# EAGLE design eeprom_emu_bt_satland_fix (EAGLE 7.6.0)
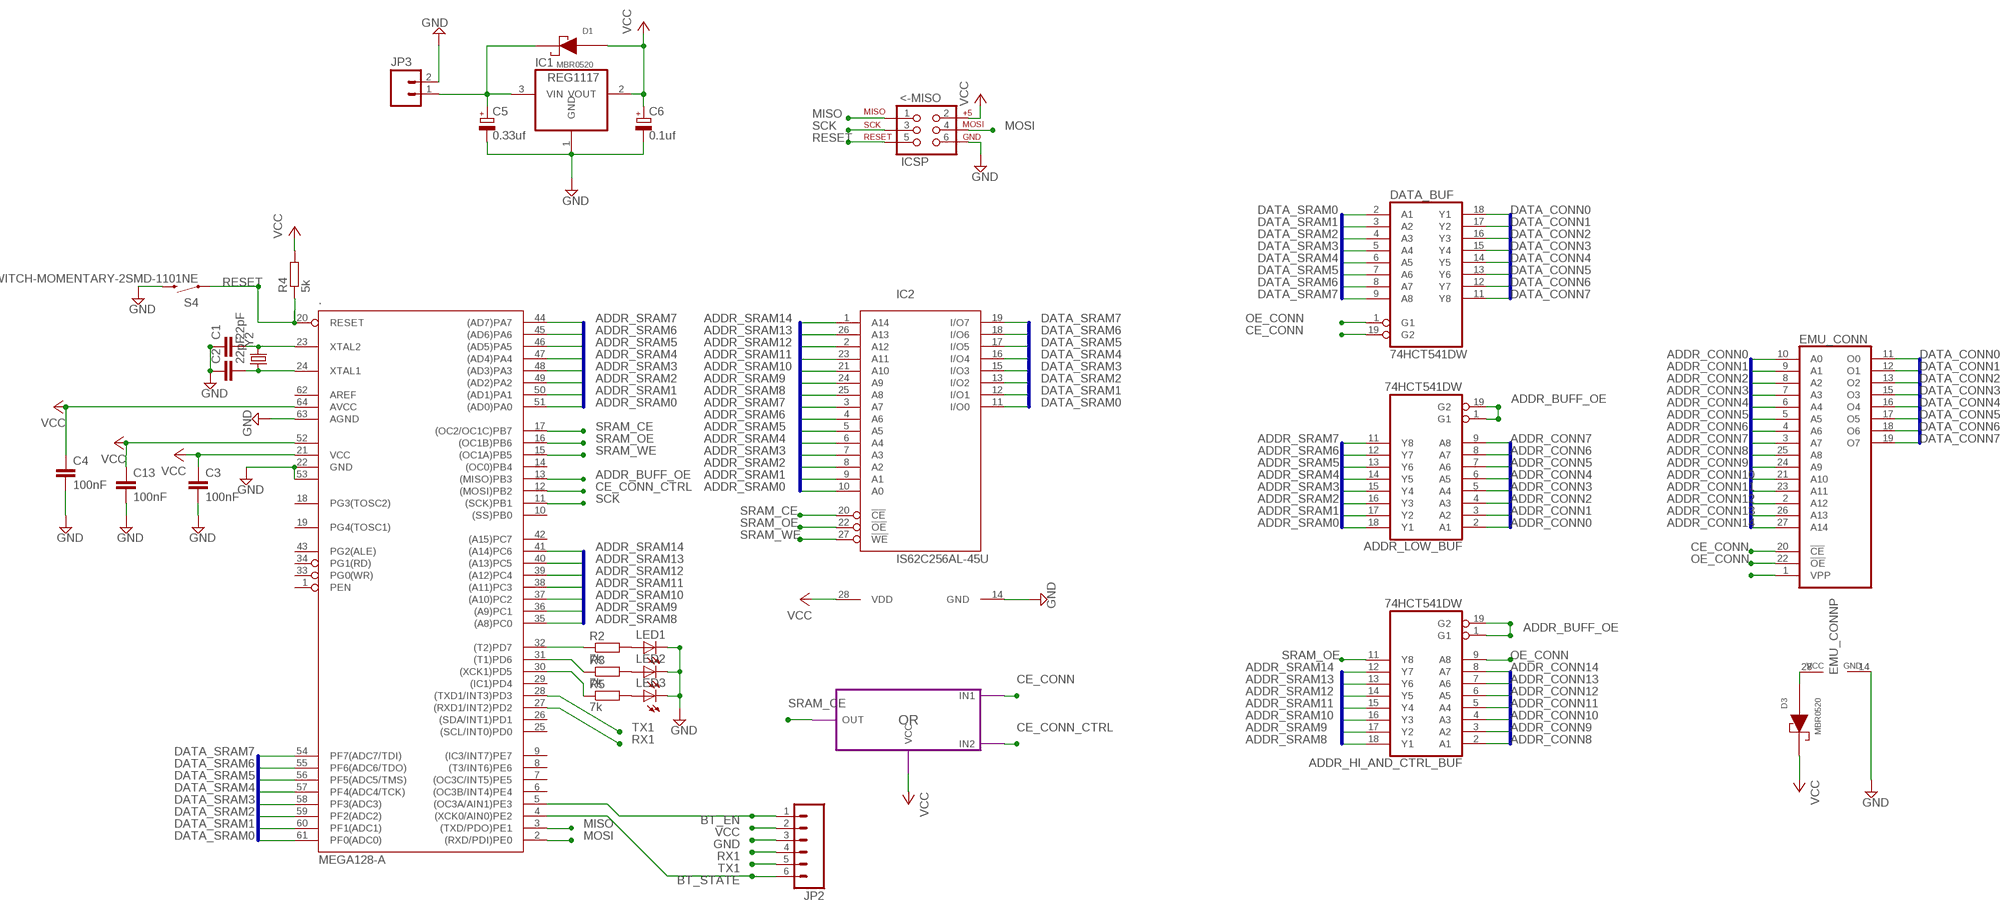
[diagram p0: schematic, sheet 1]

## Parts
.  MEGA128-A  [TQFP64]
<-MISO  ICSP  AVR_SPI_PRG_6PTH  [2X3]
ADDR_HI_AND_CTRL_BUF  74HCT541DW  [SO20W]
ADDR_LOW_BUF  74HCT541DW  [SO20W]
C1  22pF  C-EUC0805  [C0805]
C2  22pF  C-EUC0805  [C0805]
C3  100nF  C-EUC0805  [C0805]
C4  100nF  C-EUC0805  [C0805]
C5  0.33uf  CPOL-EUE5-4  [E5-4]
C6  0.1uf  CPOL-EUE5-4  [E5-4]
C13  100nF  C-EUC0805  [C0805]
D1  MBR0520  [SOD-123]
D3  MBR0520  [SOD-123]
DATA_BUF  74HCT541DW  [SO20W]
EMU_CONN  27256  [DIL28]
IC1  REG1117  [SOT223]
IC2  IS62C256AL-45U  [SOP28-330MIL]
JP2  M06SILK_FEMALE_PTH  [1X06]
JP3  M02LOCK_LONGPADS  [1X02_LOCK_LONGPADS]
LED1  LEDSML0805  [SML0805]
LED2  LEDSML0805  [SML0805]
LED3  LEDSML0805  [SML0805]
R2  7k  R-EU_R0805  [R0805]
R3  7k  R-EU_R0805  [R0805]
R4  5k  R-EU_R0805  [R0805]
R5  7k  R-EU_R0805  [R0805]
S4  SWITCH-MOMENTARY-2SMD-1101NE  [TACTILE-SWITCH-1101NE]
Y2  CRYSTALHC49UV  [HC49U-V]

## Module instances
OR = OR_GATE

## Nets
ADDR_BUFF_OE: ..13((MISO)PB3) ADDR_HI_AND_CTRL_BUF.1(G1) ADDR_HI_AND_CTRL_BUF.19(G2) ADDR_LOW_BUF.1(G1) ADDR_LOW_BUF.19(G2)
ADDR_CONN0: ADDR_LOW_BUF.2(A1) EMU_CONN.10(A0)
ADDR_CONN1: ADDR_LOW_BUF.3(A2) EMU_CONN.9(A1)
ADDR_CONN2: ADDR_LOW_BUF.4(A3) EMU_CONN.8(A2)
ADDR_CONN3: ADDR_LOW_BUF.5(A4) EMU_CONN.7(A3)
ADDR_CONN4: ADDR_LOW_BUF.6(A5) EMU_CONN.6(A4)
ADDR_CONN5: ADDR_LOW_BUF.7(A6) EMU_CONN.5(A5)
ADDR_CONN6: ADDR_LOW_BUF.8(A7) EMU_CONN.4(A6)
ADDR_CONN7: ADDR_LOW_BUF.9(A8) EMU_CONN.3(A7)
ADDR_CONN8: ADDR_HI_AND_CTRL_BUF.2(A1) EMU_CONN.25(A8)
ADDR_CONN9: ADDR_HI_AND_CTRL_BUF.3(A2) EMU_CONN.24(A9)
ADDR_CONN10: ADDR_HI_AND_CTRL_BUF.4(A3) EMU_CONN.21(A10)
ADDR_CONN11: ADDR_HI_AND_CTRL_BUF.5(A4) EMU_CONN.23(A11)
ADDR_CONN12: ADDR_HI_AND_CTRL_BUF.6(A5) EMU_CONN.2(A12)
ADDR_CONN13: ADDR_HI_AND_CTRL_BUF.7(A6) EMU_CONN.26(A13)
ADDR_CONN14: ADDR_HI_AND_CTRL_BUF.8(A7) EMU_CONN.27(A14)
ADDR_SRAM0: ..51((AD0)PA0) ADDR_LOW_BUF.18(Y1) IC2.10(A0)
ADDR_SRAM1: ..50((AD1)PA1) ADDR_LOW_BUF.17(Y2) IC2.9(A1)
ADDR_SRAM2: ..49((AD2)PA2) ADDR_LOW_BUF.16(Y3) IC2.8(A2)
ADDR_SRAM3: ..48((AD3)PA3) ADDR_LOW_BUF.15(Y4) IC2.7(A3)
ADDR_SRAM4: ..47((AD4)PA4) ADDR_LOW_BUF.14(Y5) IC2.6(A4)
ADDR_SRAM5: ..46((AD5)PA5) ADDR_LOW_BUF.13(Y6) IC2.5(A5)
ADDR_SRAM6: ..45((AD6)PA6) ADDR_LOW_BUF.12(Y7) IC2.4(A6)
ADDR_SRAM7: ..44((AD7)PA7) ADDR_LOW_BUF.11(Y8) IC2.3(A7)
ADDR_SRAM8: ..35((A8)PC0) ADDR_HI_AND_CTRL_BUF.18(Y1) IC2.25(A8)
ADDR_SRAM9: ..36((A9)PC1) ADDR_HI_AND_CTRL_BUF.17(Y2) IC2.24(A9)
ADDR_SRAM10: ..37((A10)PC2) ADDR_HI_AND_CTRL_BUF.16(Y3) IC2.21(A10)
ADDR_SRAM11: ..38((A11)PC3) ADDR_HI_AND_CTRL_BUF.15(Y4) IC2.23(A11)
ADDR_SRAM12: ..39((A12)PC4) ADDR_HI_AND_CTRL_BUF.14(Y5) IC2.2(A12)
ADDR_SRAM13: ..40((A13)PC5) ADDR_HI_AND_CTRL_BUF.13(Y6) IC2.26(A13)
ADDR_SRAM14: ..41((A14)PC6) ADDR_HI_AND_CTRL_BUF.12(Y7) IC2.1(A14)
BT_EN: ..5((OC3A/AIN1)PE3) JP2.1
BT_STATE: ..4((XCK0/AIN0)PE2) JP2.6
CE_CONN: DATA_BUF.19(G2) EMU_CONN.20(!CE) ; port OR.IN1
CE_CONN_CTRL: ..12((MOSI)PB2) ; port OR.IN2
DATA_CONN0: DATA_BUF.18(Y1) EMU_CONN.11(O0)
DATA_CONN1: DATA_BUF.17(Y2) EMU_CONN.12(O1)
DATA_CONN2: DATA_BUF.16(Y3) EMU_CONN.13(O2)
DATA_CONN3: DATA_BUF.15(Y4) EMU_CONN.15(O3)
DATA_CONN4: DATA_BUF.14(Y5) EMU_CONN.16(O4)
DATA_CONN5: DATA_BUF.13(Y6) EMU_CONN.17(O5)
DATA_CONN6: DATA_BUF.12(Y7) EMU_CONN.18(O6)
DATA_CONN7: DATA_BUF.11(Y8) EMU_CONN.19(O7)
DATA_SRAM0: ..61(PF0(ADC0)) DATA_BUF.2(A1) IC2.11(I/O0)
DATA_SRAM1: ..60(PF1(ADC1)) DATA_BUF.3(A2) IC2.12(I/O1)
DATA_SRAM2: ..59(PF2(ADC2)) DATA_BUF.4(A3) IC2.13(I/O2)
DATA_SRAM3: ..58(PF3(ADC3)) DATA_BUF.5(A4) IC2.15(I/O3)
DATA_SRAM4: ..57(PF4(ADC4/TCK)) DATA_BUF.6(A5) IC2.16(I/O4)
DATA_SRAM5: ..56(PF5(ADC5/TMS)) DATA_BUF.7(A6) IC2.17(I/O5)
DATA_SRAM6: ..55(PF6(ADC6/TDO)) DATA_BUF.8(A7) IC2.18(I/O6)
DATA_SRAM7: ..54(PF7(ADC7/TDI)) DATA_BUF.9(A8) IC2.19(I/O7)
GND: ..22(GND) ..53(GND1) ..63(AGND) <-MISO.6 C1.1 C2.1 C3.2 C4.2 C5.- C6.- C13.2 EMU_CONN.14(GND) IC1.1(GND) IC2.14(GND) JP2.3 JP3.2 LED1.C LED2.C LED3.C S4.2
MISO: ..3((TXD/PDO)PE1) <-MISO.1
MOSI: ..2((RXD/PDI)PE0) <-MISO.4
N$1: ..24(XTAL1) C2.2 Y2.1
N$2: ..23(XTAL2) C1.2 Y2.2
N$3: C5.+ D1.1(CA) IC1.3(VIN) JP3.1
N$4: D3.2(AN) EMU_CONN.28(VCC)
N$6: ..32((T2)PD7) R2.1
N$7: LED1.A R2.2
N$8: ..31((T1)PD6) R3.1
N$9: EMU_CONN.1(VPP)
N$10: LED2.A R3.2
N$11: ..30((XCK1)PD5) R5.1
N$12: LED3.A R5.2
OE_CONN: ADDR_HI_AND_CTRL_BUF.9(A8) DATA_BUF.1(G1) EMU_CONN.22(!OE)
RESET: ..20(RESET) <-MISO.5 R4.1 S4.1
RX1: ..27((RXD1/INT2)PD2) JP2.4
SCK: ..11((SCK)PB1) <-MISO.3
SRAM_CE: ..17((OC2/OC1C)PB7) IC2.20(!CE) ; port OR.OUT
SRAM_OE: ..16((OC1B)PB6) ADDR_HI_AND_CTRL_BUF.11(Y8) IC2.22(!OE)
SRAM_WE: ..15((OC1A)PB5) IC2.27(!WE)
TX1: ..28((TXD1/INT3)PD3) JP2.5
VCC: ..21(VCC) ..52(VCC1) ..64(AVCC) <-MISO.2 C3.1 C4.1 C6.+ C13.1 D1.2(AN) D3.1(CA) IC1.2(VOUT) IC2.28(VDD) JP2.2 R4.2 ; port OR.VCC
Unconnected: ..1(PEN) ..6((OC3B/INT4)PE4) ..7((OC3C/INT5)PE5) ..8((T3/INT6)PE6) ..9((IC3/INT7)PE7) ..10((SS)PB0) ..14((OC0)PB4) ..18(PG3(TOSC2)) ..19(PG4(TOSC1)) ..25((SCL/INT0)PD0) ..26((SDA/INT1)PD1) ..29((IC1)PD4) ..33(PG0(WR)) ..34(PG1(RD)) ..42((A15)PC7) ..43(PG2(ALE)) ..62(AREF)

## Buses
ADDR_SRAM[0..14]
DATA_SRAM[0..7]
DATA_CONN[0..7]
ADDR_CONN[0..7]
ADDR_CONN[8..14]
ADDR_SRAM[0..7]
ADDR_SRAM[8..14]
ADDR_CONN[0..14]

## Power pins joined to a net without a drawn wire
GND: ADDR_HI_AND_CTRL_BUF.10(GND) ADDR_LOW_BUF.10(GND) DATA_BUF.10(GND)
VCC: ADDR_HI_AND_CTRL_BUF.20(VCC) ADDR_LOW_BUF.20(VCC) DATA_BUF.20(VCC)

## Library data of the parts
. = avr-7:MEGA128: MICROCONTROLLER 128 Kbytes FLASH 4 Kbytes SRAM 4 Kbytes EEPROM DUAL USART 8-channel 10 bit ADC
<-MISO = SparkFun-Connectors:AVR_SPI_PRG_6: AVR ISP 6 Pin This is the reduced ISP connector for AVR programming. Common on Arduino. This footprint will take up less PCB space and can be used with a 10-pin to 6-pin adapter such as SKU: BOB-08508 **Special note about "TEST_POINT" package. The stop mask is on the top side, so if you want your programming test points to be on the bottom of your board, make sure to place this package on the bottom side of the board. This also ensure that the orientation to program from the bottom side will be correct.
ADDR_HI_AND_CTRL_BUF ADDR_LOW_BUF DATA_BUF = 74xx-eu:74*541: Octal BUFFER and LINE DRIVER, 3-state
C1-C4 C13 = resistor:C-EU: CAPACITOR, European symbol
C5 C6 = rcl:CPOL-EU: POLARIZED CAPACITOR, European symbol
D1 D3 = MySMD:MBR0520
EMU_CONN = memory:27256: MEMORY
IC1 = burr-brown:REG1117: 800mA and 1A Low Dropout (LDO) Positive Regulator 1.8V, 2.5V, 2.85V, 3.3V, 5V, and Adj; MPN: REG1117; OC_FARNELL: 1097566; OC_NEWARK: 14P6981
IC2 = memory-issi-asynsram:IS62C256AL-*: 32k x 8 low power CMOS static RAM 25ns and 45ns access time 5V power supply
JP2 = SparkFun-Connectors:M06: Header 6 Standard 6-pin 0.1" header. Use with straight break away headers (SKU : PRT-00116), right angle break away headers (PRT-00553), swiss pins (PRT-00743), machine pins (PRT-00117), and female headers (PRT-00115). Molex polarized connector foot print use with SKU : PRT-08094 with associated crimp pins and housings. NOTES ON THE VARIANTS LOCK and LOCK_LONGPADS... This footprint was designed to help hold the alignment of a through-hole component (i.e. 6-pin header) while soldering it into place. You may notice that each hole has been shifted either up or down by 0.005 of an inch from it's more standard position (which is a perfectly straight line). This slight alteration caused the pins (the squares in the middle) to touch the edges of the holes. Because they are alternating, it causes a "brace" to hold the component in place. 0.005 has proven to be the perfect amount of "off-center" position when using our standard breakaway headers. Although looks a little odd when you look at the bare footprint, once you have a header in there, the alteration is very hard to notice. Also,if you push a header all the way into place, it is covered up entirely on the bottom side. This idea of altering the position of holes to aid alignment will be further integrated into the Sparkfun Library for other footprints. It can help hold any component with 3 or more connection pins.; PROD_ID: CONN-08437
JP3 = SparkFun-Connectors:M02: Standard 2-pin 0.1" header. Use with - straight break away headers ( PRT-00116) - right angle break away headers (PRT-00553) - swiss pins (PRT-00743) - machine pins (PRT-00117) - female headers (PRT-00115) Molex polarized connector foot print use with: PRT-08233 with associated crimp pins and housings. 2.54_SCREWTERM for use with PRT-10571. 3.5mm Screw Terminal footprints for PRT-08084 5mm Screw Terminal footprints for use with PRT-08432
LED1-LED3 = led:LED: LED OSRAM: - CHIPLED LG R971, LG N971, LY N971, LG Q971, LY Q971, LO R971, LY R971 LH N974, LH R974 LS Q976, LO Q976, LY Q976 LO Q996 - Hyper CHIPLED LW Q18S LB Q993, LB Q99A, LB R99A - SideLED LS A670, LO A670, LY A670, LG A670, LP A670 LB A673, LV A673, LT A673, LW A673 LH A674 LY A675 LS A676, LA A676, LO A676, LY A676, LW A676 LS A679, LY A679, LG A679 - Hyper Micro SIDELED® LS Y876, LA Y876, LO Y876, LY Y876 LT Y87S - SmartLED LW L88C, LW L88S LB L89C, LB L89S, LG L890 LS L89K, LO L89K, LY L89K LS L896, LA L896, LO L896, LY L896 - TOPLED LS T670, LO T670, LY T670, LG T670, LP T670 LSG T670, LSP T670, LSY T670, LOP T670, LYG T670 LG T671, LOG T671, LSG T671 LB T673, LV T673, LT T673, LW T673 LH T674 LS T676, LA T676, LO T676, LY T676, LB T676, LH T676, LSB T676, LW T676 LB T67C, LV T67C, LT T67C, LS T67K, LO T67K, LY T67K, LW E67C LS E67B, LA E67B, LO E67B, LY E67B, LB E67C, LV E67C, LT E67C LW T67C LS T679, LY T679, LG T679 LS T770, LO T770, LY T770, LG T770, LP T770 LB T773, LV T773, LT T773, LW T773 LH T774 LS E675, LA E675, LY E675, LS T675 LS T776, LA T776, LO T776, LY T776, LB T776 LHGB T686 LT T68C, LB T68C - Hyper Mini TOPLED® LB M676 - Mini TOPLED Santana® LG M470 LS M47K, LO M47K, LY M47K Source: http://www.osram.convergy.de LUXEON: - LUMILED® LXK2-PW12-R00, LXK2-PW12-S00, LXK2-PW14-U00, LXK2-PW14-V00 LXK2-PM12-R00, LXK2-PM12-S00, LXK2-PM14-U00 LXK2-PE12-Q00, LXK2-PE12-R00, LXK2-PE12-S00, LXK2-PE14-T00, LXK2-PE14-U00 LXK2-PB12-K00, LXK2-PB12-L00, LXK2-PB12-M00, LXK2-PB14-N00, LXK2-PB14-P00, LXK2-PB14-Q00 LXK2-PR12-L00, LXK2-PR12-M00, LXK2-PR14-Q00, LXK2-PR14-R00 LXK2-PD12-Q00, LXK2-PD12-R00, LXK2-PD12-S00 LXK2-PH12-R00, LXK2-PH12-S00 LXK2-PL12-P00, LXK2-PL12-Q00, LXK2-PL12-R00 Source: www.luxeon.com KINGBRIGHT: KA-3528ASYC Source: www.kingbright.com
R2-R5 = rcl:R-EU_: RESISTOR, European symbol
S4 = SparkFun-Electromechanical:SWITCH-MOMENTARY-2: Various NO switches- pushbuttons, reed, etc; PROD_ID: SWCH-00815
Y2 = SparkFun-FreqCtrl:CRYSTAL: Various standard crystals. Proven footprints.

## Module OR_GATE
Ports: IN1(in) IN2(in) VCC(pwr) OUT(out)
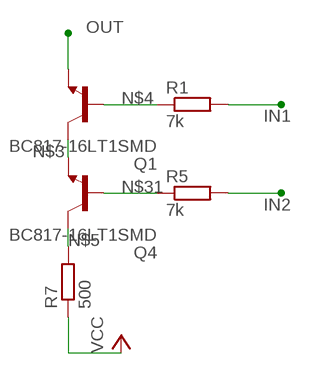
[diagram p1: schematic, module OR_GATE, sheet 1]

### Parts
Q1  BC817-16LT1SMD  [SOT23-BEC]
Q4  BC817-16LT1SMD  [SOT23-BEC]
R1  7k  R-EU_R0805  [R0805]
R5  7k  R-EU_R0805  [R0805]
R7  500  R-EU_R0805  [R0805]

### Nets
IN1: R1.2
IN2: R5.2
N$3: Q1.C Q4.E
N$4: Q1.B R1.1
N$5: Q4.C R7.2
N$31: Q4.B R5.1
OUT: Q1.E
VCC: R7.1

### Library data of the parts
Q1 Q4 = transistor-npn:BC817*: NPN Transistor
R1 R5 R7 = rcl:R-EU_: RESISTOR, European symbol

## Board
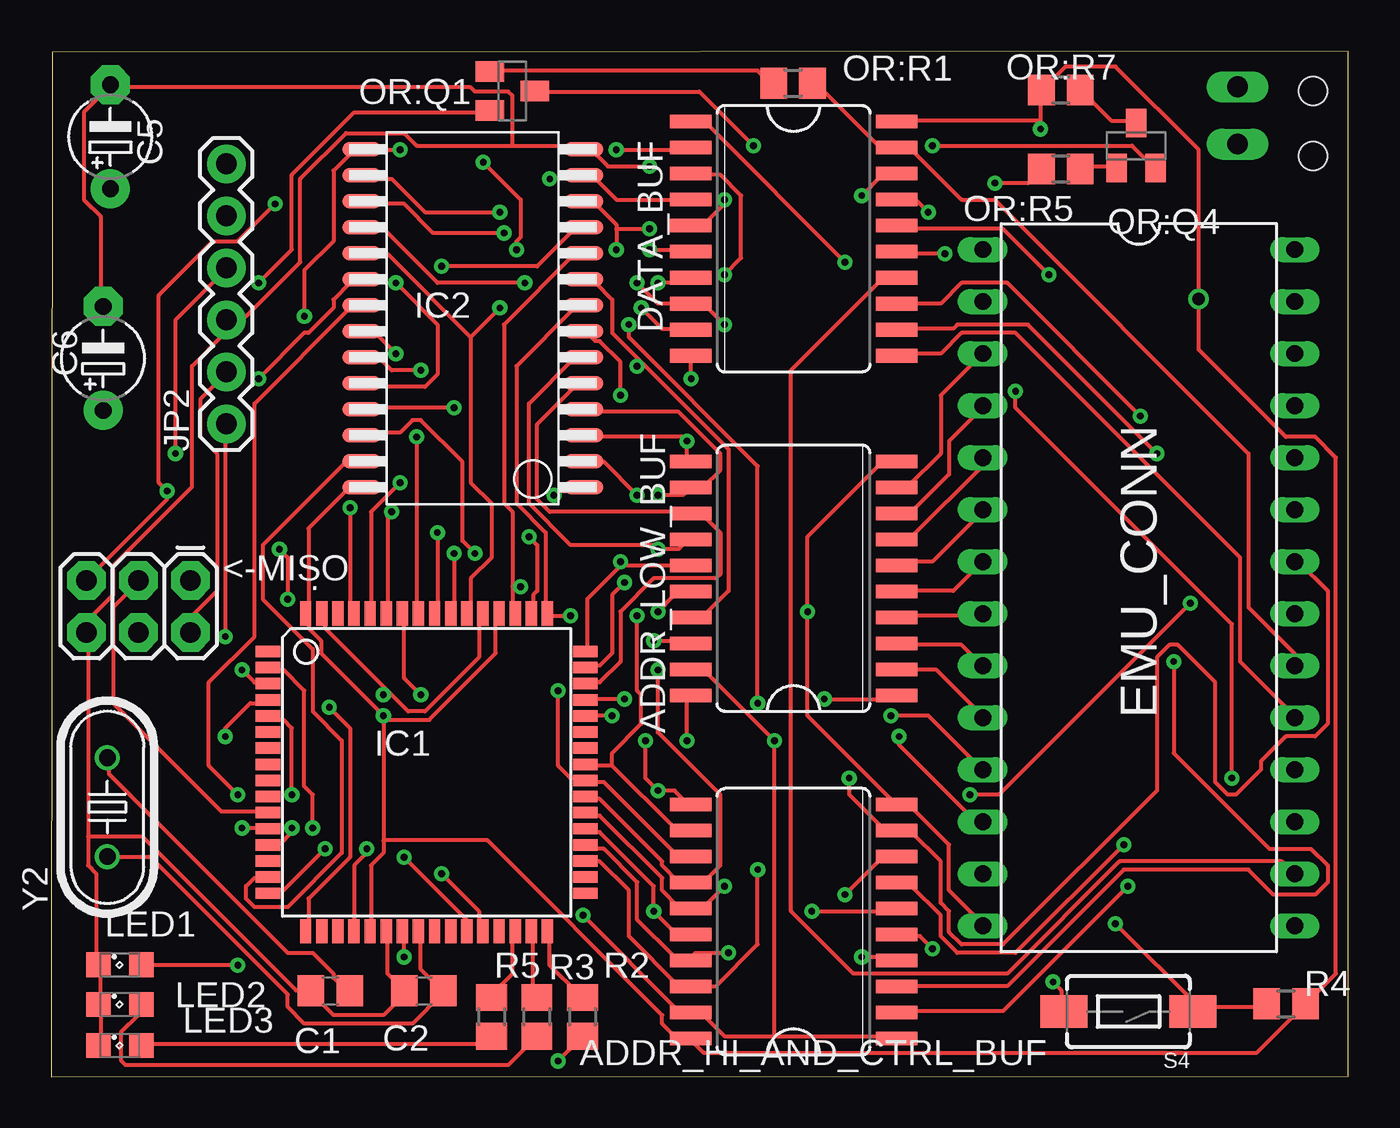
[diagram p2: board, top side]
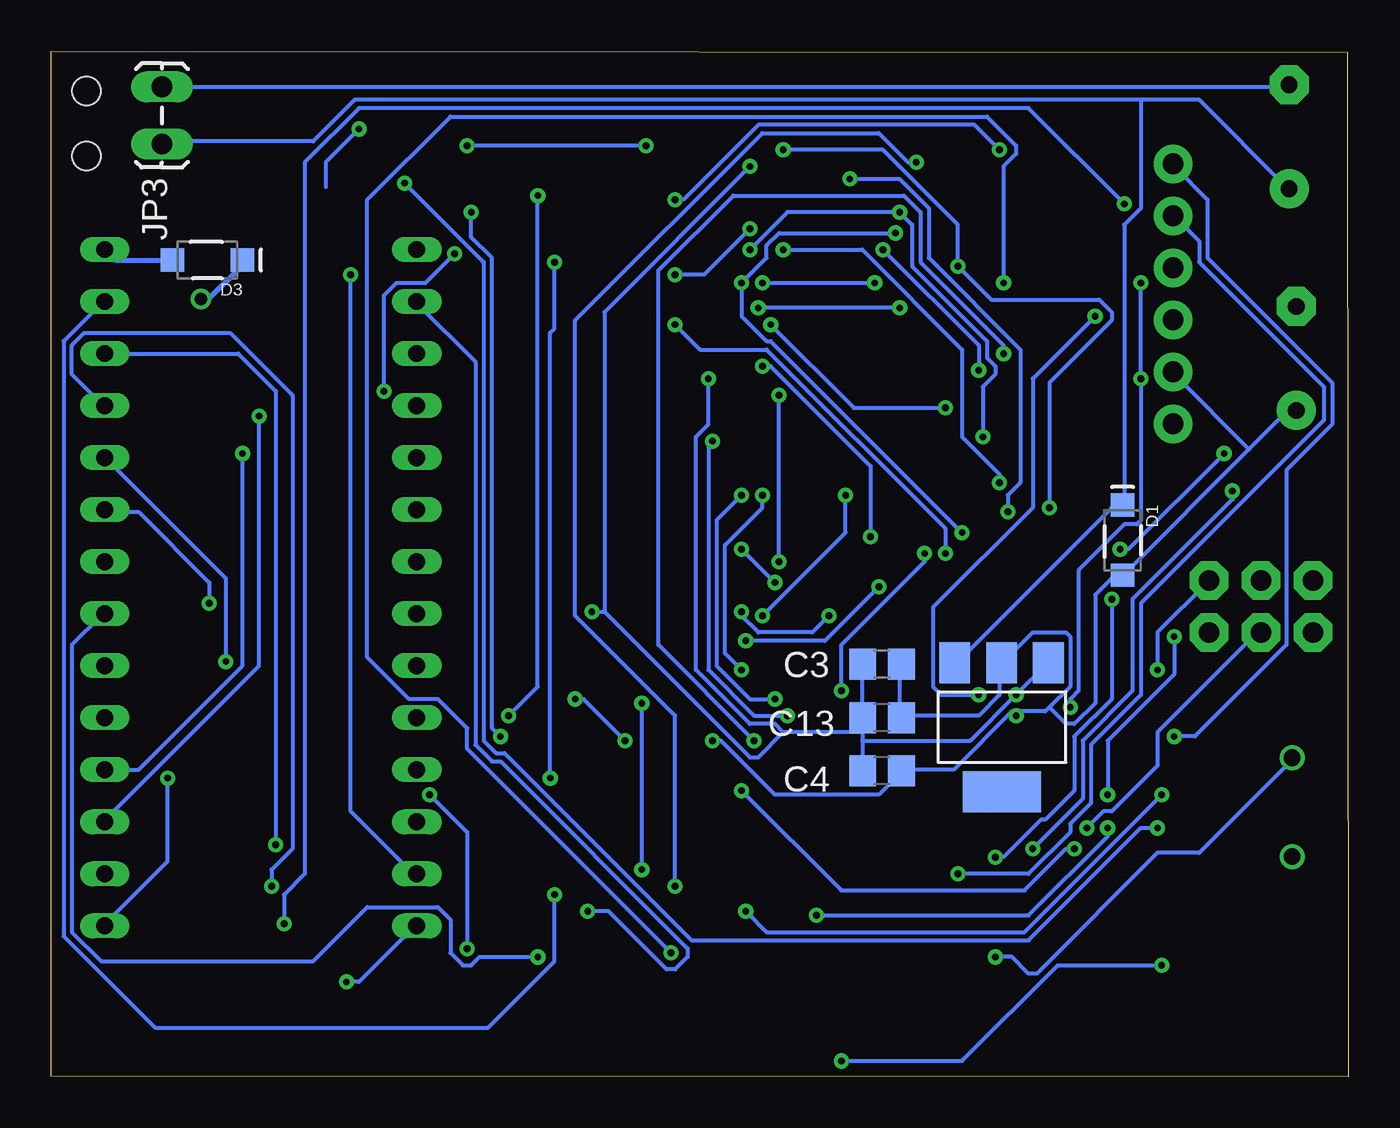
[diagram p3: board, bottom side, seen from below]

Size 63.37 x 50.08 mm. Coordinates in mm from the lower left corner, seen from the top.
Outline: 0,0 63.37,0.02 63.37,50.08 0.05,50.03 0,0
Copper layers (1*16): Top 0.0356mm / dielectric 1.5011mm / Bottom 0.0356mm
Design rules "oshpark-2layer *": minimum track width 8mil, minimum drill 13mil, track to track 8mil, track to pad 8mil, pad to pad 8mil, via to via 8mil, smd to smd 6mil, copper to edge 15mil, drill to drill 6mil, minimum pad ring 8mil, minimum via ring 8mil, stop-mask expansion 2.5mil, vias tented up to drill 0mil, thermal gap 10mil
Holes 1.4 mm at 61.65,44.96 61.65,48.13

### Footprints (pad centres in the part's own frame; a part is rotated, then mirrored left to right if it is on the bottom)
TQFP64 = smd 1.194 x 0.559: 1 -7.76,5.905; 2 -7.76,5.118; 3 -7.76,4.331; 4 -7.76,3.543; 5 -7.76,2.756; 6 -7.76,1.968; 7 -7.76,1.181; 8 -7.76,0.394; 9 -7.76,-0.394; 10 -7.76,-1.181; 11 -7.76,-1.968; 12 -7.76,-2.756; 13 -7.76,-3.543; 14 -7.76,-4.331; 15 -7.76,-5.118; 16 -7.76,-5.905; 33 7.76,-5.905; 34 7.76,-5.118; 35 7.76,-4.331; 36 7.76,-3.543; 37 7.76,-2.756; 38 7.76,-1.968; 39 7.76,-1.181; 40 7.76,-0.394; 41 7.76,0.394; 42 7.76,1.181; 43 7.76,1.968; 44 7.76,2.756; 45 7.76,3.543; 46 7.76,4.331; 47 7.76,5.118; 48 7.76,5.905 | smd 0.559 x 1.194: 17 -5.905,-7.76; 18 -5.118,-7.76; 19 -4.331,-7.76; 20 -3.543,-7.76; 21 -2.756,-7.76; 22 -1.968,-7.76; 23 -1.181,-7.76; 24 -0.394,-7.76; 25 0.394,-7.76; 26 1.181,-7.76; 27 1.968,-7.76; 28 2.756,-7.76; 29 3.543,-7.76; 30 4.331,-7.76; 31 5.118,-7.76; 32 5.905,-7.76; 49 5.905,7.76; 50 5.118,7.76; 51 4.331,7.76; 52 3.543,7.76; 53 2.756,7.76; 54 1.968,7.76; 55 1.181,7.76; 56 0.394,7.76; 57 -0.394,7.76; 58 -1.181,7.76; 59 -1.968,7.76; 60 -2.756,7.76; 61 -3.543,7.76; 62 -4.331,7.76; 63 -5.118,7.76; 64 -5.905,7.76
2X3 = drill 1.016 pad 1.88 octagon: 1 0,0; 2 0,2.54; 3 2.54,0; 4 2.54,2.54; 5 5.08,0; 6 5.08,2.54
SO20W = smd 0.66 x 2.032: 1 -5.715,-5.029; 2 -4.445,-5.029; 3 -3.175,-5.029; 4 -1.905,-5.029; 5 -0.635,-5.029; 6 0.635,-5.029; 7 1.905,-5.029; 8 3.175,-5.029; 9 4.445,-5.029; 10 5.715,-5.029; 11 5.715,5.029; 12 4.445,5.029; 13 3.175,5.029; 14 1.905,5.029; 15 0.635,5.029; 16 -0.635,5.029; 17 -1.905,5.029; 18 -3.175,5.029; 19 -4.445,5.029; 20 -5.715,5.029
C0805 = smd 1.3 x 1.5: 1 -0.95,0; 2 0.95,0
E5-4 = drill 0.813 pad 1.905: + -2.54,0 | drill 0.813 pad 1.905 octagon: - 2.54,0
SOD-123 = smd 1.143 x 1.143: 1 0,0; 2 3.429,0
DIL28 = drill 0.813 long: 1 -16.51,-7.62; 2 -13.97,-7.62; 3 -11.43,-7.62; 4 -8.89,-7.62; 5 -6.35,-7.62; 6 -3.81,-7.62; 7 -1.27,-7.62; 8 1.27,-7.62; 9 3.81,-7.62; 10 6.35,-7.62; 11 8.89,-7.62; 12 11.43,-7.62; 13 13.97,-7.62; 14 16.51,-7.62; 15 16.51,7.62; 16 13.97,7.62; 17 11.43,7.62; 18 8.89,7.62; 19 6.35,7.62; 20 3.81,7.62; 21 1.27,7.62; 22 -1.27,7.62; 23 -3.81,7.62; 24 -6.35,7.62; 25 -8.89,7.62; 26 -11.43,7.62; 27 -13.97,7.62; 28 -16.51,7.62
SOT223 = smd 1.499 x 2.007: 1 -2.261,-3.15; 2 0.025,-3.15; 3 2.311,-3.15 | smd 3.81 x 2.007: 4 0,3.15
SOP28-330MIL = smd 0.7 x 1.9: 1 -8.255,-5.415; 2 -6.985,-5.415; 3 -5.715,-5.415; 4 -4.445,-5.415; 5 -3.175,-5.415; 6 -1.905,-5.415; 7 -0.635,-5.415; 8 0.635,-5.415; 9 1.905,-5.415; 10 3.175,-5.415; 11 4.445,-5.415; 12 5.715,-5.415; 13 6.985,-5.415; 14 8.255,-5.415; 15 8.255,5.415; 16 6.985,5.415; 17 5.715,5.415; 18 4.445,5.415; 19 3.175,5.415; 20 1.905,5.415; 21 0.635,5.415; 22 -0.635,5.415; 23 -1.905,5.415; 24 -3.175,5.415; 25 -4.445,5.415; 26 -5.715,5.415; 27 -6.985,5.415; 28 -8.255,5.415
1X06 = drill 1.016 pad 1.88: 1 0,0; 2 2.54,0; 3 5.08,0; 4 7.62,0; 5 10.16,0; 6 12.7,0
1X02_LOCK_LONGPADS = drill 1.016 long: 1 -0.127,0; 2 2.667,0
SML0805 = smd 1.2 x 1.2: A 1.05,0; C -1.05,0
SOT23-BEC = smd 1 x 1.4: B -0.95,-1.1; C 0,1.1; E 0.95,-1.1
R0805 = smd 1.3 x 1.5: 1 -0.95,0; 2 0.95,0
TACTILE-SWITCH-1101NE = smd 2.3 x 1.6: 1 -3.15,0; 2 3.15,0
HC49U-V = drill 0.813: 1 -2.413,0; 2 2.413,0

### Placement (x,y rotation side)
.  18.34,14.86 0 top
<-MISO  6.81,24.23 180 top
ADDR_HI_AND_CTRL_BUF  36.27,7.57 90 top
ADDR_LOW_BUF  36.27,24.33 90 top
C1  13.64,4.19 0 top
C2  18.21,4.19 0 top
C3  22.78,20.14 180 bottom
C4  22.78,14.94 180 bottom
C5  2.9,45.9 90 top
C6  2.54,35.08 90 top
C13  22.78,17.53 180 bottom
D1  11.02,27.91 270 bottom
D3  54.03,39.88 180 bottom
DATA_BUF  36.27,40.92 270 top
EMU_CONN  53.14,23.88 270 top
IC1  16.92,17.07 180 bottom
IC2  20.6,37.03 90 top
JP2  8.56,31.88 90 top
JP3  57.96,45.67 90 bottom
LED1  3.35,5.46 0 top
LED2  3.35,3.53 0 top
LED3  3.35,1.52 0 top
OR:Q1  BC817-16LT1SMD  [SOT23-BEC]  22.53,48.13 270 top
OR:Q4  BC817-16LT1SMD  [SOT23-BEC]  53.01,45.47 0 top
OR:R1  7k  [R0805]  36.25,48.51 0 top
OR:R5  7k  [R0805]  49.33,44.32 180 top
OR:R7  500  [R0805]  49.33,48.18 0 top
R2  25.96,2.92 270 top
R3  23.72,2.92 270 top
R4  60.33,3.56 0 top
R5  21.51,2.92 270 top
S4  52.63,3.17 180 top
Y2  2.74,13.16 90 top

### Tracks (layer width: path | path; a pad name or v marks a point on that pad's centre or on a via)
ADDR_BUFF_OE  (via drill 0.33)
  Top 0.203: v11.76,12.14 11.76,11.94 11.15,11.33 10.74,11.33 ..13 | v25.98,7.87 30.66,3.2 31.06,3.2 ADDR_HI_AND_CTRL_BUF.19 31.27,3 31.88,3 32.89,1.98 35.33,1.98 | 35.33,1.98 41.22,1.98 ADDR_HI_AND_CTRL_BUF.1 | 35.33,1.98 v35.33,16.41 31.88,19.86 31.27,19.86 ADDR_LOW_BUF.19 | v37.77,18.44 41.22,18.44 ADDR_LOW_BUF.1
  Bottom 0.203: v11.76,12.14 11.76,11.73 15.62,7.87 v25.98,7.87 | v37.77,18.44 37.36,18.44 v35.33,16.41
ADDR_CONN0
  Top 0.203: ADDR_LOW_BUF.2 41.43,19.86 43.26,19.86 45.49,17.63 EMU_CONN.10
ADDR_CONN1
  Top 0.203: ADDR_LOW_BUF.3 41.43,21.08 44.48,21.08 45.49,20.07 EMU_CONN.9
ADDR_CONN2
  Top 0.203: ADDR_LOW_BUF.4 41.43,22.5 45.49,22.5 EMU_CONN.8
ADDR_CONN3
  Top 0.203: ADDR_LOW_BUF.5 41.43,23.72 44.07,23.72 45.49,25.15 EMU_CONN.7
ADDR_CONN4
  Top 0.203: ADDR_LOW_BUF.6 41.43,25.15 43.05,25.15 45.49,27.58 EMU_CONN.6
ADDR_CONN5
  Top 0.203: ADDR_LOW_BUF.7 41.43,26.36 42.04,26.36 45.49,29.82 45.49,30.23 EMU_CONN.5
ADDR_CONN6
  Top 0.203: ADDR_LOW_BUF.8 41.43,27.58 42.04,27.58 43.87,29.41 43.87,31.04 45.49,32.66 EMU_CONN.4
ADDR_CONN7
  Top 0.203: ADDR_LOW_BUF.9 41.43,28.8 41.83,28.8 43.46,30.43 43.46,33.27 45.49,35.31 EMU_CONN.3
ADDR_CONN8  (via drill 0.33)
  Top 0.203: v52.6,9.3 46.51,3.2 41.43,3.2 ADDR_HI_AND_CTRL_BUF.2
  Bottom 0.203: v52.6,9.3 52.6,10.11 51.59,11.12 51.59,33.27 54.64,36.32 61.75,36.32 62.36,35.71 62.36,34.29 60.93,32.87 EMU_CONN.25
ADDR_CONN9  (via drill 0.33)
  Top 0.203: v54.84,20.27 54.84,15.8 59.51,11.12 61.54,11.12 62.36,10.31 62.36,9.5 61.75,8.89 59.72,8.89 58.5,10.11 52.4,10.11 46.71,4.42 41.43,4.42 ADDR_HI_AND_CTRL_BUF.3
  Bottom 0.203: v54.84,20.27 54.84,24.33 60.73,30.23 EMU_CONN.24
ADDR_CONN10  (via drill 0.33)
  Top 0.203: v39.6,5.84 41.22,5.84 ADDR_HI_AND_CTRL_BUF.4
  Bottom 0.203: v39.6,5.84 42.44,5.84 42.85,5.44 43.26,5.44 43.87,6.04 43.87,7.67 44.48,8.28 47.93,8.28 50.57,5.64 60.93,5.64 62.36,7.06 62.36,21.08 60.93,22.5 EMU_CONN.21
ADDR_CONN11  (via drill 0.33)
  Top 0.203: v43.05,6.25 42.44,6.86 41.43,6.86 ADDR_HI_AND_CTRL_BUF.5 | v44.88,13.77 46.3,13.77 v55.65,23.11
  Bottom 0.203: v43.05,6.25 43.05,11.94 v44.88,13.77 | v55.65,23.11 55.65,24.13 59.11,27.58 60.73,27.58 EMU_CONN.23
ADDR_CONN12  (via drill 0.33)
  Top 0.203: v37.16,8.08 41.22,8.08 ADDR_HI_AND_CTRL_BUF.6
  Bottom 0.203: v37.16,8.08 36.14,8.08 33.3,5.23 32.89,5.23 32.28,5.84 32.28,6.25 41.43,15.39 41.83,15.39 42.65,16.2 42.65,34.9 45.49,37.74 EMU_CONN.2
ADDR_CONN13  (via drill 0.33)
  Top 0.203: v52.4,11.33 47.12,6.04 44.27,6.04 43.46,6.86 43.46,7.87 42.04,9.3 41.43,9.3 ADDR_HI_AND_CTRL_BUF.7
  Bottom 0.203: v52.4,11.33 52.4,33.48 54.23,35.31 EMU_CONN.26
ADDR_CONN14  (via drill 0.33)
  Top 0.203: v38.79,8.89 40.61,10.72 41.22,10.72 ADDR_HI_AND_CTRL_BUF.8
  Bottom 0.203: v38.79,8.89 38.79,5.64 42.04,2.39 58.29,2.39 62.76,6.86 62.76,35.92 60.93,37.74 EMU_CONN.27
ADDR_SRAM0  (via drill 0.33)
  Top 0.203: 22.53,23.93 22.53,27.58 22.12,27.99 22.12,36.73 25.58,40.18 25.98,40.18 IC2.10 | 22.53,23.93 22.53,22.71 ..51 | v29.44,21.29 31.06,21.29 ADDR_LOW_BUF.18 | 22.53,23.93 v22.94,23.93
  Bottom 0.203: v29.44,21.29 25.58,21.29 v22.94,23.93
ADDR_SRAM1  (via drill 0.33)
  Top 0.203: v23.34,26.36 23.75,25.96 23.75,23.72 23.55,23.52 23.55,22.71 ..50 | 28.63,35.1 v28.63,34.7 | 28.63,35.1 27.41,36.32 27.41,37.95 26.59,38.76 26.19,38.76 IC2.9 | 28.63,35.1 33.1,30.63 33.1,23.72 31.88,22.5 31.27,22.5 ADDR_LOW_BUF.17
  Bottom 0.203: v23.34,26.36 23.34,29.82 28.22,34.7 v28.63,34.7
ADDR_SRAM2  (via drill 0.33)
  Top 0.203: IC2.8 25.98,37.54 25.58,37.54 22.73,34.7 22.73,27.99 24.16,26.57 24.16,22.71 ..49 24.36,22.5 v25.37,22.5 | v29.64,22.71 30.45,23.52 31.06,23.52 ADDR_LOW_BUF.16
  Bottom 0.203: v29.64,22.71 29.64,22.5 28.83,21.69 26.19,21.69 v25.37,22.5
ADDR_SRAM3  (via drill 0.33)
  Top 0.203: 27.81,24.94 26.19,23.32 26.19,20.88 ..48 | 27.81,24.94 31.06,24.94 ADDR_LOW_BUF.15 | v27.81,33.27 27.81,34.9 26.8,35.92 26.59,35.92 26.19,36.32 IC2.7 | 27.81,24.94 v27.81,25.15
  Bottom 0.203: v27.81,25.15 v27.81,33.27
ADDR_SRAM4  (via drill 0.33)
  Top 0.203: v28.02,24.13 27.41,23.52 27.41,20.68 26.8,20.07 26.19,20.07 ..47 | ADDR_LOW_BUF.14 31.06,26.16 30.66,25.76 v29.64,25.76 29.44,25.96 25.37,25.96 23.34,27.99 23.34,32.87 25.58,35.1 25.98,35.1 IC2.6
  Bottom 0.203: v29.64,25.76 v28.02,24.13
ADDR_SRAM5
  Top 0.203: ..46 26.19,19.25 26.8,19.25 27.81,20.27 27.81,22.71 29.44,24.33 32.49,24.33 32.69,24.54 32.69,26.57 31.88,27.38 31.27,27.38 ADDR_LOW_BUF.13 31.06,27.58 24.36,27.58 23.75,28.19 23.75,31.85 25.58,33.68 25.98,33.68 IC2.5
ADDR_SRAM6  (via drill 0.33)
  Top 0.203: v28.02,18.44 26.19,18.44 ..45 | v29.64,28.4 30.86,28.4 ADDR_LOW_BUF.12 31.27,28.8 31.88,28.8 32.69,29.62 32.69,30.43 30.66,32.46 26.19,32.46 IC2.4
  Bottom 0.203: v28.02,18.44 29.24,18.44 30.86,20.07 30.86,27.18 v29.64,28.4
ADDR_SRAM7  (via drill 0.33)
  Top 0.203: v27.41,17.63 26.19,17.63 ..44 | ADDR_LOW_BUF.11 31.06,30.23 v31.06,31.04 30.86,31.24 26.19,31.24 IC2.3
  Bottom 0.203: v27.41,17.63 29.03,17.63 31.27,19.86 31.27,30.84 v31.06,31.04
ADDR_SRAM8  (via drill 0.33)
  Top 0.203: ..35 26.19,10.52 26.8,10.52 28.22,9.09 28.22,6.86 30.66,4.42 31.06,4.42 ADDR_HI_AND_CTRL_BUF.18 31.27,4.42 32.49,4.42 34.52,6.45 v34.52,10.11 | v19.68,32.66 15.21,32.66 IC2.25 | v28.22,36.73 28.22,36.12 34.52,29.82 v34.52,18.24
  Bottom 0.203: v19.68,32.66 24.16,32.66 v28.22,36.73 | v34.52,10.11 v34.52,18.24
ADDR_SRAM9  (via drill 0.33)
  Top 0.203: ..36 26.19,11.12 27,11.12 28.63,9.5 28.63,7.67 30.45,5.84 31.06,5.84 ADDR_HI_AND_CTRL_BUF.17 31.27,5.84 31.47,6.04 v33.1,6.04 | v16.84,38.76 18.87,36.73 18.87,34.29 18.26,33.68 15.21,33.68 IC2.24
  Bottom 0.203: v16.84,38.76 16.84,44.45 16.23,45.06 16.23,45.47 17.65,46.89 43.87,46.89 47.93,42.82 47.93,20.47 45.9,18.44 44.48,18.44 43.05,17.02 43.05,16 v33.1,6.04
ADDR_SRAM10  (via drill 0.33)
  Top 0.203: ..37 26.19,11.94 26.8,11.94 29.44,9.3 v29.44,8.08 30.45,7.06 31.06,7.06 ADDR_HI_AND_CTRL_BUF.16 | v9.12,13.77 7.7,15.19 7.7,19.25 9.93,21.49 9.93,32.87 14.6,37.54 15.01,37.54 IC2.21
  Bottom 0.203: v9.12,13.77 15.82,7.06 28.42,7.06 v29.44,8.08
ADDR_SRAM11  (via drill 0.33)
  Top 0.203: ..38 26.19,12.75 26.8,12.75 29.84,9.7 29.84,9.09 30.66,8.28 31.06,8.28 ADDR_HI_AND_CTRL_BUF.15 31.27,8.28 31.88,8.28 v32.89,9.3 | v18.06,34.49 16.64,34.49 16.03,35.1 15.21,35.1 IC2.23 | v22.73,40.39 22.73,40.79 22.94,41 22.94,42.82 v21.11,44.65
  Bottom 0.203: v18.06,34.49 18.06,35.71 v22.73,40.39 | v21.11,44.65 21.51,44.65 22.94,46.08 28.63,46.08 37.77,36.93 37.77,22.5 32.89,17.63 v32.89,9.3
ADDR_SRAM12  (via drill 0.33)
  Top 0.203: ..39 26.19,13.56 26.8,13.56 29.84,10.52 29.84,10.31 30.66,9.5 31.06,9.5 ADDR_HI_AND_CTRL_BUF.14 31.27,9.5 31.88,9.5 32.69,10.31 32.69,13.77 29.64,16.82 v29.64,19.86 | v28.63,28.4 27,30.02 26.19,30.02 IC2.2
  Bottom 0.203: v28.63,28.4 28.63,27.79 30.45,25.96 30.45,20.68 v29.64,19.86
ADDR_SRAM13  (via drill 0.33)
  Top 0.203: ADDR_HI_AND_CTRL_BUF.13 31.06,10.92 30.45,10.92 27,14.38 26.19,14.38 ..40 25.98,14.58 25.37,14.58 24.76,15.19 v24.76,18.85 | v20.7,25.55 20.09,26.16 20.09,30.02 18.06,32.05 17.65,32.05 17.04,31.44 15.21,31.44 IC2.26
  Bottom 0.203: v20.7,25.55 20.7,25.15 24.76,21.08 v24.76,18.85
ADDR_SRAM14  (via drill 0.33)
  Top 0.203: 27.41,15.19 26.19,15.19 ..41 | 27.41,15.19 30.45,12.14 31.06,12.14 ADDR_HI_AND_CTRL_BUF.12 | v24.56,28.4 24.76,28.6 25.98,28.6 IC2.1 | v28.63,22.5 28.63,18.85 28.83,18.64 28.83,17.22 27.41,15.8 27.41,15.19
  Bottom 0.203: v24.56,28.4 24.56,26.57 v28.63,22.5
BT_EN  (via drill 0.33)
  Top 0.203: v11.76,13.77 11.76,17.02 11.35,17.42 10.74,17.42 ..5 | v8.51,21.49 8.51,31.85 JP2.1
  Bottom 0.203: v11.76,13.77 11.76,16.41 8.51,19.66 v8.51,21.49
BT_STATE  (via drill 0.33)
  Top 0.203: v8.51,16.61 8.51,17.02 9.73,18.24 10.54,18.24 ..4
  Bottom 0.203: v8.51,16.61 7.49,16.61 3.02,21.08 3.02,29.62 0.79,31.85 0.79,33.88 6.88,39.98 6.88,42.82 8.51,44.45 JP2.6
CE_CONN
  Top 0.203: OR:R1.2 37.36,48.51 40.41,45.47 41.22,45.47 DATA_BUF.19 41.43,45.26 42.04,45.26 44.48,42.82 46.1,42.82 58.5,30.43 58.5,22.91 60.73,20.68 60.73,20.07 EMU_CONN.20
CE_CONN_CTRL  (via drill 0.33)
  Top 0.203: v9.32,12.14 10.54,12.14 ..12 | v46.1,43.64 47.73,43.64 48.34,44.25 OR:R5.2
  Bottom 0.203: v9.32,12.14 10.13,12.14 15.62,6.65 32.08,6.65 41.22,15.8 41.63,15.8 42.24,16.41 42.24,39.78 v46.1,43.64
DATA_CONN0  (via drill 0.33)
  Top 0.203: v39.6,43.03 40.61,44.04 41.22,44.04 DATA_BUF.18 | v41.02,17.63 42.85,17.63 45.49,14.99 EMU_CONN.11
  Bottom 0.203: v39.6,43.03 39.6,19.05 v41.02,17.63
DATA_CONN1  (via drill 0.33)
  Top 0.203: DATA_BUF.17 42.24,42.82 v42.85,42.22 | v41.43,16.61 41.43,16.2 45.08,12.55 45.49,12.55 EMU_CONN.12
  Bottom 0.203: v42.85,42.22 42.85,41 41.83,39.98 41.83,17.02 v41.43,16.61
DATA_CONN2  (via drill 0.33)
  Top 0.203: v48.74,39.17 46.51,41.4 41.43,41.4 DATA_BUF.16
  Bottom 0.203: v48.74,39.17 48.74,12.95 45.69,9.91 EMU_CONN.13
DATA_CONN3  (via drill 0.33)
  Top 0.203: v43.66,40.18 41.43,40.18 DATA_BUF.15 | v47.12,33.48 47.12,32.66 57.68,22.1 v57.68,14.58
  Bottom 0.203: v43.66,40.18 45.08,38.76 46.51,38.76 47.12,38.15 v47.12,33.48 | v57.68,14.58 57.68,10.52 60.73,7.47 EMU_CONN.15
DATA_CONN4
  Top 0.203: DATA_BUF.14 41.22,38.96 40.61,38.96 36.14,34.49 36.14,8.08 39.19,5.03 46.71,5.03 52.2,10.52 60.12,10.52 60.73,9.91 EMU_CONN.16
DATA_CONN5  (via drill 0.33)
  Top 0.203: DATA_BUF.13 43.46,37.74 44.48,38.76 46.71,38.76 v53.21,32.26
  Bottom 0.203: v53.21,32.26 53.21,20.07 60.73,12.55 EMU_CONN.17
DATA_CONN6  (via drill 0.33)
  Top 0.203: v54.03,30.43 47.73,36.73 44.27,36.73 44.07,36.53 41.43,36.53 DATA_BUF.12
  Bottom 0.203: v54.03,30.43 54.03,20.07 59.11,14.99 EMU_CONN.18
DATA_CONN7
  Top 0.203: DATA_BUF.11 41.43,35.31 43.46,35.31 44.48,36.32 47.12,36.32 58.09,25.35 58.09,20.27 60.73,17.63 EMU_CONN.19
DATA_SRAM0  (via drill 0.33)
  Top 0.203: v14.6,27.79 14.6,22.71 ..61 | v19.08,39.57 23.75,39.57 25.58,41.4 25.98,41.4 IC2.11 | v27.61,45.26 31.06,45.26 DATA_BUF.2
  Bottom 0.203: v14.6,27.79 14.6,33.88 11.56,36.93 11.56,37.34 12.17,37.95 17.45,37.95 v19.08,39.57 19.08,41.61 22.73,45.26 v27.61,45.26
DATA_SRAM1  (via drill 0.33)
  Top 0.203: v17.04,29.01 15.62,27.58 15.62,22.71 ..60 | 27.61,41.4 27.61,41.61 26.59,42.62 26.19,42.62 IC2.12 | 27.61,41.4 v27.61,40.39 | v32.89,39.17 33.71,39.98 33.71,43.03 32.69,44.04 31.27,44.04 DATA_BUF.3 | 27.61,41.4 v29.24,41.4
  Bottom 0.203: v17.04,29.01 17.04,29.41 18.87,31.24 18.87,35.51 23.75,40.39 v27.61,40.39 | v32.89,39.17 31.47,39.17 v29.24,41.4
DATA_SRAM2  (via drill 0.33)
  Top 0.203: v16.64,27.58 16.43,27.38 16.43,22.71 ..59 | v24.36,43.84 25.98,43.84 IC2.13 26.19,43.84 26.59,43.84 27.61,42.82 DATA_BUF.4
  Bottom 0.203: v16.64,27.58 16.64,28.4 16.03,29.01 16.03,35.51 20.5,39.98 20.5,42.42 21.92,43.84 v24.36,43.84
DATA_SRAM3  (via drill 0.33)
  Top 0.203: v18.06,18.64 17.25,19.46 17.25,22.5 ..58 | v12.37,37.14 12.37,39.37 13.79,40.79 13.79,44.25 15.01,45.47 IC2.15 15.21,45.26 v17.04,45.26 | v32.89,42.82 32.89,42.62 31.88,41.61 31.27,41.61 DATA_BUF.5
  Bottom 0.203: v18.06,18.64 19.89,18.64 20.29,19.05 20.29,22.91 15.42,27.79 15.42,34.09 v12.37,37.14 | v32.89,42.82 32.49,42.82 28.83,46.48 18.26,46.48 v17.04,45.26
DATA_SRAM4  (via drill 0.33)
  Top 0.203: v17.86,31.24 17.86,22.71 ..57 | v21.92,42.22 18.26,42.22 16.64,43.84 15.21,43.84 IC2.16 | v29.24,40.39 31.06,40.39 DATA_BUF.6
  Bottom 0.203: v17.86,31.24 17.86,33.68 17.25,34.29 17.25,34.7 17.65,35.1 17.65,35.92 21.31,39.57 21.31,41.61 v21.92,42.22 27.41,42.22 v29.24,40.39
DATA_SRAM5  (via drill 0.33)
  Top 0.203: v18.87,26.57 18.87,22.71 ..56 | v29.64,38.76 30.86,38.76 31.06,38.96 DATA_BUF.7 | v22.12,41.2 18.67,41.2 17.25,42.62 15.21,42.62 IC2.17
  Bottom 0.203: v18.87,26.57 28.22,35.92 28.42,35.92 29.64,37.14 v29.64,38.76 28.42,39.98 28.42,40.59 27.81,41.2 v22.12,41.2
DATA_SRAM6  (via drill 0.33)
  Top 0.203: v19.68,25.55 19.68,22.71 ..55 | v32.89,36.73 31.88,37.74 DATA_BUF.8 29.64,37.74 v28.63,38.76 | v23.14,38.76 18.87,38.76 16.23,41.4 15.21,41.4 IC2.18
  Bottom 0.203: v19.68,25.55 19.68,26.77 28.42,35.51 31.67,35.51 v32.89,36.73 | v28.63,38.76 v23.14,38.76
DATA_SRAM7  (via drill 0.33)
  Top 0.203: 20.5,36.12 20.5,29.01 21.51,27.99 21.51,25.35 20.5,24.33 20.5,22.71 ..54 | 20.5,36.12 16.43,40.18 15.21,40.18 IC2.19 | v28.83,37.54 29.84,36.53 31.06,36.53 DATA_BUF.9 | 20.5,36.12 v21.92,37.54
  Bottom 0.203: v21.92,37.54 v28.83,37.54
GND  (via drill 0.33)
  Top 0.203: C6.- 2.41,37.74 2.41,42.01 1.6,42.82 1.6,47.09 2.82,48.31 C5.- 3.02,48.31 20.5,48.31 20.7,48.11 22.33,48.11 22.53,47.9 22.53,45.47 | 16.43,18.85 17.45,17.83 18.26,17.83 20.9,20.47 20.9,22.5 ..53 | 16.43,18.85 13.39,21.89 13.39,22.5 ..63 | v31.27,34.09 31.27,35.1 DATA_BUF.10 | v16.23,18.64 16.43,18.85 | EMU_CONN.14 45.49,7.47 43.87,9.09 43.87,11.33 42.04,13.16 41.43,13.16 ADDR_HI_AND_CTRL_BUF.10 36.96,17.63 v36.96,22.71 36.96,26.36 40.61,30.02 41.22,30.02 ADDR_LOW_BUF.10 | v48.95,4.62 49.35,4.22 49.35,3.2 S4.2 | 22.53,45.47 17.86,45.47 17.25,46.08 14.4,46.08 12.17,43.84 12.17,39.78 9.52,37.14 8.71,37.14 JP2.3 8.51,36.93 8.51,36.32 6.88,34.7 6.88,28.8 3.02,24.94 3.02,23.52 1.8,22.3 1.8,21.69 | 22.53,45.47 25.98,45.47 IC2.14 26.19,45.47 27.2,44.45 v29.24,44.45 | ..22 16.43,7.06 16.43,5.03 17.25,4.22 C2.1 17.25,4.01 16.23,3 13.79,3 12.78,4.01 C1.1 12.57,4.22 11.96,4.22 4.44,11.73 1.8,11.73 | LED3.C 2.41,1.57 2.41,3.4 LED2.C 2.41,3.61 2.41,5.44 LED1.C 2.21,5.64 2.21,9.91 1.8,10.31 1.8,11.73 | 1.8,21.69 1.8,11.73 | 1.8,21.69 <-MISO.6
  Bottom 0.203: JP3.2 57.89,48.31 3.02,48.31 C5.- | 23.75,16.82 23.75,17.42 C13.2 | 23.75,16.82 23.75,16.41 | 23.75,16.41 23.75,14.99 C4.2 | C3.2 23.75,20.07 23.75,17.63 C13.2 | IC1.1 v16.23,18.64 18.47,16.41 23.75,16.41 | v31.27,34.09 31.27,31.85 31.88,31.24 31.88,19.86 29.24,17.22 28.02,17.22 27.61,16.82 | 23.75,16.82 27.61,16.82 | 23.75,16.82 C13.2 | v48.95,4.62 48.34,4.62 45.69,7.26 EMU_CONN.14 | 27.61,16.82 28.83,15.6 29.24,15.6 36.35,22.71 | v36.96,22.71 36.35,22.71 | 36.35,22.71 36.35,37.34 v29.24,44.45
MISO  (via drill 0.33)
  Top 0.203: v9.32,19.86 9.93,19.25 10.54,19.25 ..3
  Bottom 0.203: v9.32,19.86 9.32,21.69 6.88,24.13 <-MISO.1
MOSI  (via drill 0.33)
  Top 0.203: v12.78,12.14 12.78,13.77 12.37,14.17 12.37,18.85 11.35,19.86 10.74,19.86 ..2
  Bottom 0.203: v12.78,12.14 11.96,12.95 11.56,12.95 9.32,15.19 9.32,16.82 4.44,21.69 <-MISO.4
N$1
  Top 0.203: ..24 18.06,7.06 18.06,5.23 19.08,4.22 C2.2 19.08,4.01 17.65,2.59 12.37,2.59 11.56,3.4 11.56,4.01 4.85,10.72 2.82,10.72 Y2.1
N$2  (via drill 0.33)
  Top 0.203: v17.25,5.84 17.25,7.06 ..23 | C1.2 14.4,4.22 13.79,4.83 13.79,5.03 12.78,6.04 11.56,6.04 2.82,14.78 2.82,15.39 Y2.2
  Bottom 0.203: v17.25,5.84 16.43,5.84 15.62,5.03 15.21,5.03 9.32,10.92 7.29,10.92 2.82,15.39 Y2.2
N$3
  Bottom 0.203: IC1.3 19.08,20.27 11.56,27.79 11.15,27.79 D1.1 10.95,27.99 10.95,41.61 10.13,42.42 10.13,47.7 | 10.13,47.7 7.29,47.7 3.02,43.43 C5.+ | 10.13,47.7 48.54,47.7 50.57,45.67 57.89,45.67 JP3.1
N$4
  Bottom 0.254: D3.2 60.25,39.88 EMU_CONN.28
N$6
  Top 0.203: ..32 24.36,7.06 24.36,5.44 25.78,4.01 R2.1
N$7  (via drill 0.33)
  Top 0.203: v9.12,5.44 4.44,5.44 LED1.A | v24.76,0.76 25.78,1.78 R2.2
  Bottom 0.203: v9.12,5.44 14.2,5.44 18.87,0.76 v24.76,0.76
N$8
  Top 0.203: ..31 23.55,7.06 23.55,4.01 R3.1
N$10
  Top 0.203: LED2.A 4.24,3.4 4.24,3 3.43,2.18 3.43,0.76 3.63,0.56 22.33,0.56 23.55,1.78 R3.2
N$11
  Top 0.203: ..30 22.53,7.06 22.53,5.03 21.51,4.01 R5.1
N$12
  Top 0.203: LED3.A 4.44,1.57 21.31,1.57 21.51,1.78 R5.2
OE_CONN  (via drill 0.33)
  Top 0.203: EMU_CONN.22 60.93,25.15 62.36,23.72 62.36,17.22 61.75,16.61 60.32,16.61 59.11,15.39 59.11,14.99 57.89,13.77 57.48,13.77 56.87,14.38 56.87,19.25 55.04,21.08 54.64,21.08 54.03,20.47 54.03,13.97 46.51,6.45 44.48,6.45 43.87,7.06 43.87,8.08 43.46,8.48 43.46,10.52 42.04,11.94 41.43,11.94 ADDR_HI_AND_CTRL_BUF.9 41.22,12.14 40.61,12.14 38.99,13.77 v38.99,14.58 | v38.79,39.78 32.08,46.48 31.27,46.48 DATA_BUF.1
  Bottom 0.203: v38.79,39.78 38.79,36.53 38.99,36.32 v38.99,14.58
OR:N$3  (via drill 0.33)
  Top 0.203: v43.05,45.47 52.81,45.47 53.82,44.45 OR:Q4.E | v34.32,45.47 31.67,48.11 23.75,48.11 OR:Q1.C
  Bottom 0.203: v34.32,45.47 v43.05,45.47
OR:N$4
  Top 0.203: OR:Q1.B 21.51,49.12 34.52,49.12 35.13,48.51 OR:R1.1
OR:N$5
  Top 0.203: OR:Q4.C 53.01,46.69 51.79,46.69 50.37,48.11 OR:R7.2
OR:N$31
  Top 0.203: OR:Q4.B 51.99,44.45 50.37,44.45 OR:R5.1
RESET  (via drill 0.33)
  Top 0.203: 56.06,3.4 59.31,3.4 R4.1 | 56.06,3.4 55.85,3.2 S4.1 56.06,3.4 | v15.42,11.12 15.42,10.92 14.81,10.31 14.81,7.26 ..20 | <-MISO.5 1.8,24.33 5.66,28.19 v5.66,28.6 5.26,29.01 5.26,38.15 7.9,40.79 9.12,40.79 v10.95,42.62 | v51.99,7.47 56.06,3.4
  Bottom 0.203: v15.42,11.12 12.98,13.56 12.98,16.41 10.54,18.85 10.54,23.32 5.66,28.19 v5.66,28.6 | v51.99,7.47 51.99,8.89 50.98,9.91 50.98,44.65 48.34,47.3 15.62,47.3 v10.95,42.62
RX1  (via drill 0.33)
  Top 0.203: v17.25,10.72 20.29,7.67 20.29,7.26 ..27 | v11.56,23.32 11.56,25.35 v11.15,25.76 | v6.07,30.43 6.07,36.93 8.51,39.37 JP2.4
  Bottom 0.203: v17.25,10.72 16.84,10.72 15.01,12.55 14.81,12.55 13.39,13.97 13.39,16.61 11.56,18.44 v11.56,23.32 | v11.15,25.76 10.74,25.76 v6.07,30.43
SCK
  Top 0.203: ..11 10.54,12.95 8.31,12.95 3.02,18.24 3.02,22.91 4.24,24.13 <-MISO.3
SRAM_CE  (via drill 0.33)
  Top 0.203: v13.59,18.03 14.6,17.02 14.6,10.72 12.57,8.69 12.57,7.26 ..17 | v10.13,34.09 12.37,36.32 12.57,36.32 13.79,37.54 13.79,37.95 14.6,38.76 15.01,38.76 IC2.20 | v10.13,38.76 11.76,40.39 11.76,44.04 14.81,47.09 21.31,47.09 OR:Q1.E
  Bottom 0.203: v13.59,18.03 13.59,18.44 13.18,18.85 13.18,24.74 10.95,26.97 10.34,26.97 10.13,27.18 v10.13,34.09 v10.13,38.76
SRAM_OE  (via drill 0.33)
  Top 0.203: v13.39,11.12 11.35,9.09 10.74,9.09 ..16 | ADDR_HI_AND_CTRL_BUF.11 31.06,13.36 30.45,13.97 v29.64,13.97 29.03,14.58 v29.03,16.41 | v16.84,35.31 15.82,36.32 15.21,36.32 IC2.22
  Bottom 0.203: v13.39,11.12 13.79,11.12 15.82,9.09 24.76,9.09 v29.64,13.97 | v16.84,35.31 16.84,35.71 20.9,39.78 20.9,42.22 21.72,43.03 30.05,43.03 33.71,39.37 33.71,21.08 v29.03,16.41
SRAM_WE
  Top 0.203: ..15 10.54,9.7 9.93,9.7 9.52,9.3 9.52,8.69 9.93,8.28 11.56,8.28 14.2,10.92 14.2,16.41 12.78,17.83 12.78,20.88 10.34,23.32 10.34,25.96 14.4,30.02 15.01,30.02 IC2.27
TX1  (via drill 0.33)
  Top 0.203: v19.08,9.91 20.9,8.08 20.9,7.26 ..28
  Bottom 0.203: v19.08,9.91 15.62,9.91 13.59,11.94 13.59,12.34 12.57,13.36 12.57,16.2 10.13,18.64 10.13,23.11 1.19,32.05 1.19,33.68 7.29,39.78 7.29,40.79 8.51,42.01 JP2.5
VCC  (via drill 0.33, 0.6 pad 0.25)
  Top 0.203: v31.06,16.41 31.06,18.44 ADDR_LOW_BUF.20 | <-MISO.2 6.88,21.69 6.88,22.5 8.1,23.72 8.1,30.43 7.29,31.24 7.29,33.07 8.51,34.29 JP2.2 | IC2.28 15.01,28.6 14.4,28.6 12.57,26.77 12.57,22.71 ..64 12.57,22.5 12.57,21.89 13.18,21.29 13.18,20.68 v16.23,17.63 16.23,17.42 | 16.23,17.42 16.23,11.53 | 16.23,11.53 16.23,10.92 15.62,10.31 15.62,7.26 ..21 | 16.23,17.42 18.47,17.42 21.72,20.68 21.72,22.5 ..52 | 48.34,46.69 48.34,48.11 OR:R7.1 48.54,48.31 49.56,49.33 51.99,49.33 56.06,45.26 v56.06,37.97 56.06,35.51 60.32,31.24 61.75,31.24 62.76,30.23 62.76,5.03 61.34,3.61 R4.2 61.14,3.4 58.9,1.17 31.88,1.17 31.27,1.78 ADDR_HI_AND_CTRL_BUF.20 31.06,1.98 30.45,1.98 29.84,2.59 29.84,3 21.31,11.53 16.23,11.53 | 48.34,46.69 v48.34,46.28 | 48.34,46.69 41.43,46.69 DATA_BUF.20
  Bottom 0.203: C3.1 21.92,20.07 21.92,17.63 C13.1 21.72,17.63 18.06,17.63 17.04,18.64 17.04,20.07 IC1.2 16.84,20.27 15.42,21.69 13.79,21.69 13.59,21.49 13.59,19.05 14.6,18.03 | 16.23,17.83 14.81,17.83 14.6,18.03 | 16.23,17.83 16.43,17.83 19.28,14.99 21.72,14.99 C4.1 21.92,14.78 22.94,13.77 28.02,13.77 30.66,16.41 v31.06,16.41 | 4.85,30.63 3.02,32.46 2.62,32.46 C6.+ | 4.85,30.63 10.95,24.54 D1.2 11.15,24.33 11.56,24.33 12.37,23.52 12.37,18.24 13.39,17.22 13.79,17.22 14.6,18.03 | 4.85,30.63 8.51,34.29 JP2.2 | 49.96,43.43 49.96,44.65 v48.34,46.28 | v16.23,17.63 16.23,17.83
  Bottom 0.254: D3.1 53.77,39.88 56.06,37.59 v56.06,37.97